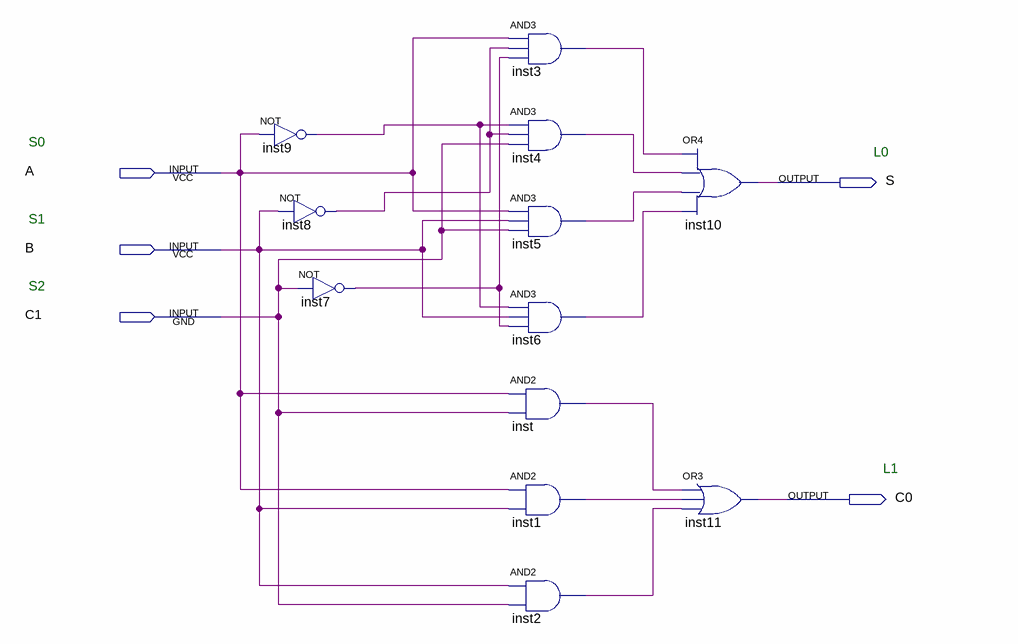
[diagram p0: schematic sheet]
// Quartus schematic exercise1.bdf as structural Verilog: 12 symbols, 5 pins
module exercise1 (
  input  A,
  input  B,
  input  C1,
  output S,
  output C0
);

  wire inst1_out, inst2_out, inst3_out, inst4_out, inst5_out, inst6_out, inst7_out, inst8_out, inst9_out,
       inst_out;

  not inst9 (inst9_out, A);
  not inst8 (inst8_out, B);
  not inst7 (inst7_out, C1);
  and inst3 (inst3_out, A, inst8_out, inst7_out);
  and inst4 (inst4_out, inst9_out, inst8_out, C1);
  and inst5 (inst5_out, A, B, C1);
  and inst6 (inst6_out, inst9_out, B, inst7_out);
  and inst (inst_out, A, C1);
  and inst1 (inst1_out, A, B);
  and inst2 (inst2_out, B, C1);
  or inst10 (S, inst3_out, inst4_out, inst5_out, inst6_out);
  or inst11 (C0, inst_out, inst1_out, inst2_out);

  // Notes on the sheet:
  //   S0
  //   L0
  //   S1
  //   S2
  //   L1
endmodule
